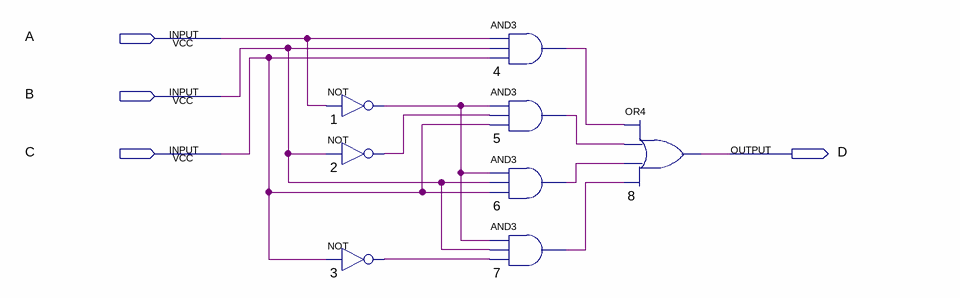
[diagram p0: schematic sheet]
// Quartus schematic Soma_Produtos.bdf as structural Verilog: 8 symbols, 4 pins
module Soma_Produtos (
  input  A,
  input  B,
  input  C,
  output D
);

  wire n1_out, n2_out, n3_out, n4_out, n5_out, n6_out, n7_out;

  not u_1 (n1_out, A);
  not u_2 (n2_out, B);
  not u_3 (n3_out, C);
  and u_4 (n4_out, A, B, C);
  and u_5 (n5_out, n1_out, n2_out, C);
  and u_6 (n6_out, n1_out, B, C);
  and u_7 (n7_out, n1_out, B, n3_out);
  or u_8 (D, n4_out, n5_out, n6_out, n7_out);
endmodule
